# Altium schematic sheet FPGA1.SchDoc: FPGA1
size A; Revision: 04
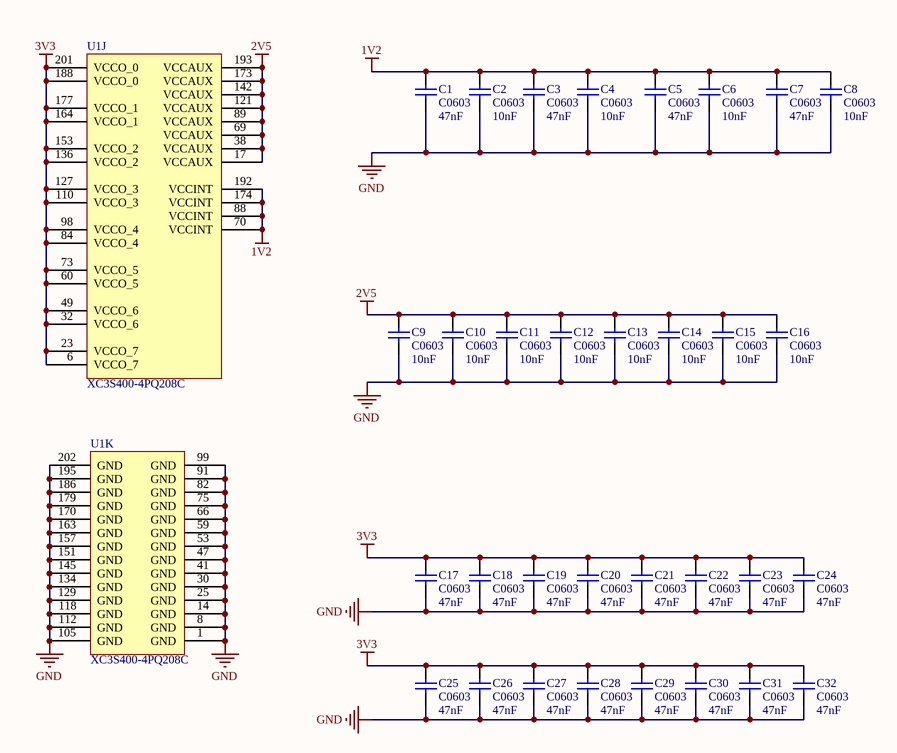
[diagram p0: FPGA1.SchDoc]

## Parts
C1  C0603  value 47nF  [0603]
C2  C0603  value 10nF  [0603]
C3  C0603  value 47nF  [0603]
C4  C0603  value 10nF  [0603]
C5  C0603  value 47nF  [0603]
C6  C0603  value 10nF  [0603]
C7  C0603  value 47nF  [0603]
C8  C0603  value 10nF  [0603]
C9  C0603  value 10nF  [0603]
C10  C0603  value 10nF  [0603]
C11  C0603  value 10nF  [0603]
C12  C0603  value 10nF  [0603]
C13  C0603  value 10nF  [0603]
C14  C0603  value 10nF  [0603]
C15  C0603  value 10nF  [0603]
C16  C0603  value 10nF  [0603]
C17  C0603  value 47nF  [0603]
C18  C0603  value 47nF  [0603]
C19  C0603  value 47nF  [0603]
C20  C0603  value 47nF  [0603]
C21  C0603  value 47nF  [0603]
C22  C0603  value 47nF  [0603]
C23  C0603  value 47nF  [0603]
C24  C0603  value 47nF  [0603]
C25  C0603  value 47nF  [0603]
C26  C0603  value 47nF  [0603]
C27  C0603  value 47nF  [0603]
C28  C0603  value 47nF  [0603]
C29  C0603  value 47nF  [0603]
C30  C0603  value 47nF  [0603]
C31  C0603  value 47nF  [0603]
C32  C0603  value 47nF  [0603]
U1  XC3S400-4PQ208C  [PQ208_N]  (parts J,K of 11)

## Nets
1V2: C1.2 C2.2 C3.2 C4.2 C5.2 C6.2 C7.2 C8.2 U1.70(VCCINT) U1.88(VCCINT) U1.174(VCCINT) U1.192(VCCINT)
2V5: C9.2 C10.2 C11.2 C12.2 C13.2 C14.2 C15.2 C16.2 U1.17(VCCAUX) U1.38(VCCAUX) U1.69(VCCAUX) U1.89(VCCAUX) U1.121(VCCAUX) U1.142(VCCAUX) U1.173(VCCAUX) U1.193(VCCAUX)
3V3: C17.2 C18.2 C19.2 C20.2 C21.2 C22.2 C23.2 C24.2 C25.2 C26.2 C27.2 C28.2 C29.2 C30.2 C31.2 C32.2 U1.6(VCCO_7) U1.23(VCCO_7) U1.32(VCCO_6) U1.49(VCCO_6) U1.60(VCCO_5) U1.73(VCCO_5) U1.84(VCCO_4) U1.98(VCCO_4) U1.110(VCCO_3) U1.127(VCCO_3) U1.136(VCCO_2) U1.153(VCCO_2) U1.164(VCCO_1) U1.177(VCCO_1) U1.188(VCCO_0) U1.201(VCCO_0)
GND: C1.1 C2.1 C3.1 C4.1 C5.1 C6.1 C7.1 C8.1 C9.1 C10.1 C11.1 C12.1 C13.1 C14.1 C15.1 C16.1 C17.1 C18.1 C19.1 C20.1 C21.1 C22.1 C23.1 C24.1 C25.1 C26.1 C27.1 C28.1 C29.1 C30.1 C31.1 C32.1 U1.1(GND) U1.8(GND) U1.14(GND) U1.25(GND) U1.30(GND) U1.41(GND) U1.47(GND) U1.53(GND) U1.59(GND) U1.66(GND) U1.75(GND) U1.82(GND) U1.91(GND) U1.99(GND) U1.105(GND) U1.112(GND) U1.118(GND) U1.129(GND) U1.134(GND) U1.145(GND) U1.151(GND) U1.157(GND) U1.163(GND) U1.170(GND) U1.179(GND) U1.186(GND) U1.195(GND) U1.202(GND)

## Notes on the sheet
- Engineer:
- Title:
- Saleh Jamali
- Revision:

## Library data of the parts
C1-C32 = C0603: Ceramic Chip Capacitor - Standard; Note: Footprint corresponds to dimensions for bulk cassette packaging. This case size has tightened tolerances.; Published: 17-Jul-2002; LatestRevisionDate: 19-Mar-2004; LatestRevisionNote: Silkscreen size reduced.; DatasheetDocument: Mar-2001; PackageDocument: Mar-2001; PackageReference: 0603; Publisher: Altium Limited; Code_JEITA: 0603; Code_IPC: 1608 [0603]; ComponentLink1Description: Manufacturer Link; ComponentLink1URL: http://www.kemet.com/; ComponentLink2Description: Datasheet; ComponentLink2URL: http://www.kemet.com/kemet/web/homepage/kechome.nsf/vapubfilesname/F3102TA.pdf/$file/F3102TA.pdf
U1 = XC3S400-4PQ208C: Spartan-3 1.2V FPGA, 141 User I/Os, 208-Pin PQFP, Standard Performance, Commercial Grade; OrderingInformation: Additional code may have to be appended for different mask revision devices.; DatasheetVersion: ver2.5, Dec-2009; PackageVersion: ver1.2, Jun-2004; PackageReference: PQ208; PackageDescription: 208-Pin Plastic Quad Flat Pack (PQ208); Code_JEDEC: MS-029-FA-1; ComponentLink1Description: Manufacturer URL; ComponentLink1URL: http://www.xilinx.com/; ComponentLink2Description: Spartan-3 Datasheet; ComponentLink2URL: http://www.xilinx.com/support/documentation/data_sheets/ds099.pdf; ComponentLink3Description: PQ208 Package Drawing; ComponentLink3URL: http://www.xilinx.com/support/documentation/package_specs/pq208.pdf; ComponentLink4Description: Spartan-3 Documents; ComponentLink4URL: http://www.xilinx.com/support/documentation/spartan-3.htm